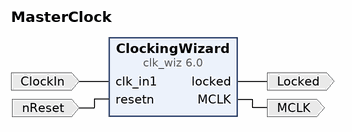
[diagram p0: block diagram of the top level]
# Vivado block design MasterClock, xc7z010clg400-1, Vivado 2020.2
create_bd_design MasterClock

create_bd_port -dir I -type clk ClockIn
set_property -dict {CONFIG.ASSOCIATED_RESET nReset CONFIG.FREQ_HZ 125000000} [get_bd_ports ClockIn]
create_bd_port -dir O Locked
create_bd_port -dir I -type rst nReset
create_bd_port -dir O -type clk MCLK
set_property -dict {CONFIG.FREQ_HZ 11290322} [get_bd_ports MCLK]

create_bd_cell -type ip -vlnv xilinx.com:ip:clk_wiz:6.0 ClockingWizard
set_property -dict [list \
  CONFIG.CLKIN1_JITTER_PS 80.0 \
  CONFIG.CLKOUT1_DRIVES BUFG \
  CONFIG.CLKOUT1_JITTER 212.631 \
  CONFIG.CLKOUT1_PHASE_ERROR 219.418 \
  CONFIG.CLKOUT1_REQUESTED_OUT_FREQ 11.289 \
  CONFIG.CLKOUT2_DRIVES BUFG \
  CONFIG.CLKOUT2_JITTER 124.615 \
  CONFIG.CLKOUT2_PHASE_ERROR 96.948 \
  CONFIG.CLKOUT2_USED false \
  CONFIG.CLKOUT3_DRIVES BUFG \
  CONFIG.CLKOUT4_DRIVES BUFG \
  CONFIG.CLKOUT5_DRIVES BUFG \
  CONFIG.CLKOUT6_DRIVES BUFG \
  CONFIG.CLKOUT7_DRIVES BUFG \
  CONFIG.CLK_OUT1_PORT MCLK \
  CONFIG.CLK_OUT2_PORT clk_out2 \
  CONFIG.FEEDBACK_SOURCE FDBK_AUTO \
  CONFIG.JITTER_SEL Min_O_Jitter \
  CONFIG.MMCM_BANDWIDTH HIGH \
  CONFIG.MMCM_CLKFBOUT_MULT_F 56 \
  CONFIG.MMCM_CLKIN1_PERIOD 8.000 \
  CONFIG.MMCM_CLKIN2_PERIOD 10.000 \
  CONFIG.MMCM_CLKOUT0_DIVIDE_F 124 \
  CONFIG.MMCM_CLKOUT1_DIVIDE 1 \
  CONFIG.MMCM_COMPENSATION ZHOLD \
  CONFIG.MMCM_DIVCLK_DIVIDE 5 \
  CONFIG.NUM_OUT_CLKS 1 \
  CONFIG.PRIMITIVE PLL \
  CONFIG.PRIM_SOURCE Single_ended_clock_capable_pin \
  CONFIG.RESET_PORT resetn \
  CONFIG.RESET_TYPE ACTIVE_LOW \
] [get_bd_cells ClockingWizard]

# ---- connections ----

connect_bd_net -net clk_in1_0_1 [get_bd_ports ClockIn] [get_bd_pins ClockingWizard/clk_in1]
connect_bd_net -net clk_wiz_0_locked [get_bd_pins ClockingWizard/locked] [get_bd_ports Locked]
connect_bd_net -net resetn_0_1 [get_bd_ports nReset] [get_bd_pins ClockingWizard/resetn]
connect_bd_net [get_bd_pins ClockingWizard/MCLK] [get_bd_ports MCLK]

validate_bd_design
save_bd_design
